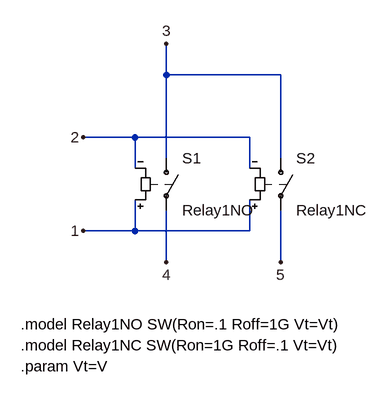
[diagram p0: schematic relay.asc]
relay.asc, the LTspice schematic file:
Version 4
SHEET 1 880 680
WIRE 112 -64 112 -112
WIRE 288 -64 112 -64
WIRE 64 32 -16 32
WIRE 240 32 64 32
WIRE 112 64 112 -64
WIRE 288 64 288 -64
WIRE 64 80 64 32
WIRE 240 80 240 32
WIRE 64 176 64 128
WIRE 64 176 -16 176
WIRE 240 176 240 128
WIRE 240 176 64 176
WIRE 112 224 112 144
WIRE 288 224 288 144
FLAG -16 176 1
FLAG -16 32 2
FLAG 112 -112 3
FLAG 112 224 4
FLAG 288 224 5
SYMBOL sw 112 48 R0
SYMATTR InstName S1
SYMATTR Value Relay1NO
SYMBOL sw 288 48 R0
SYMATTR InstName S2
SYMATTR Value Relay1NC
TEXT -112 320 Left 2 !.model Relay1NO SW(Ron=.1 Roff=1G Vt=Vt)
TEXT -112 352 Left 2 !.model Relay1NC SW(Ron=1G Roff=.1 Vt=Vt)
TEXT -112 384 Left 2 !.param Vt=V

The netlist it stands for:
* relay.asc
S1 3 4 1 2 Relay1NO
S2 3 5 1 2 Relay1NC
.model Relay1NO SW(Ron=.1 Roff=1G Vt=Vt)
.model Relay1NC SW(Ron=1G Roff=.1 Vt=Vt)
.param Vt=V
.backanno
.end